# Altium schematic sheet 60_RESISTANCE_FRONTEND.SchDoc
size A; SheetNumber: 7; SheetTotal: 8
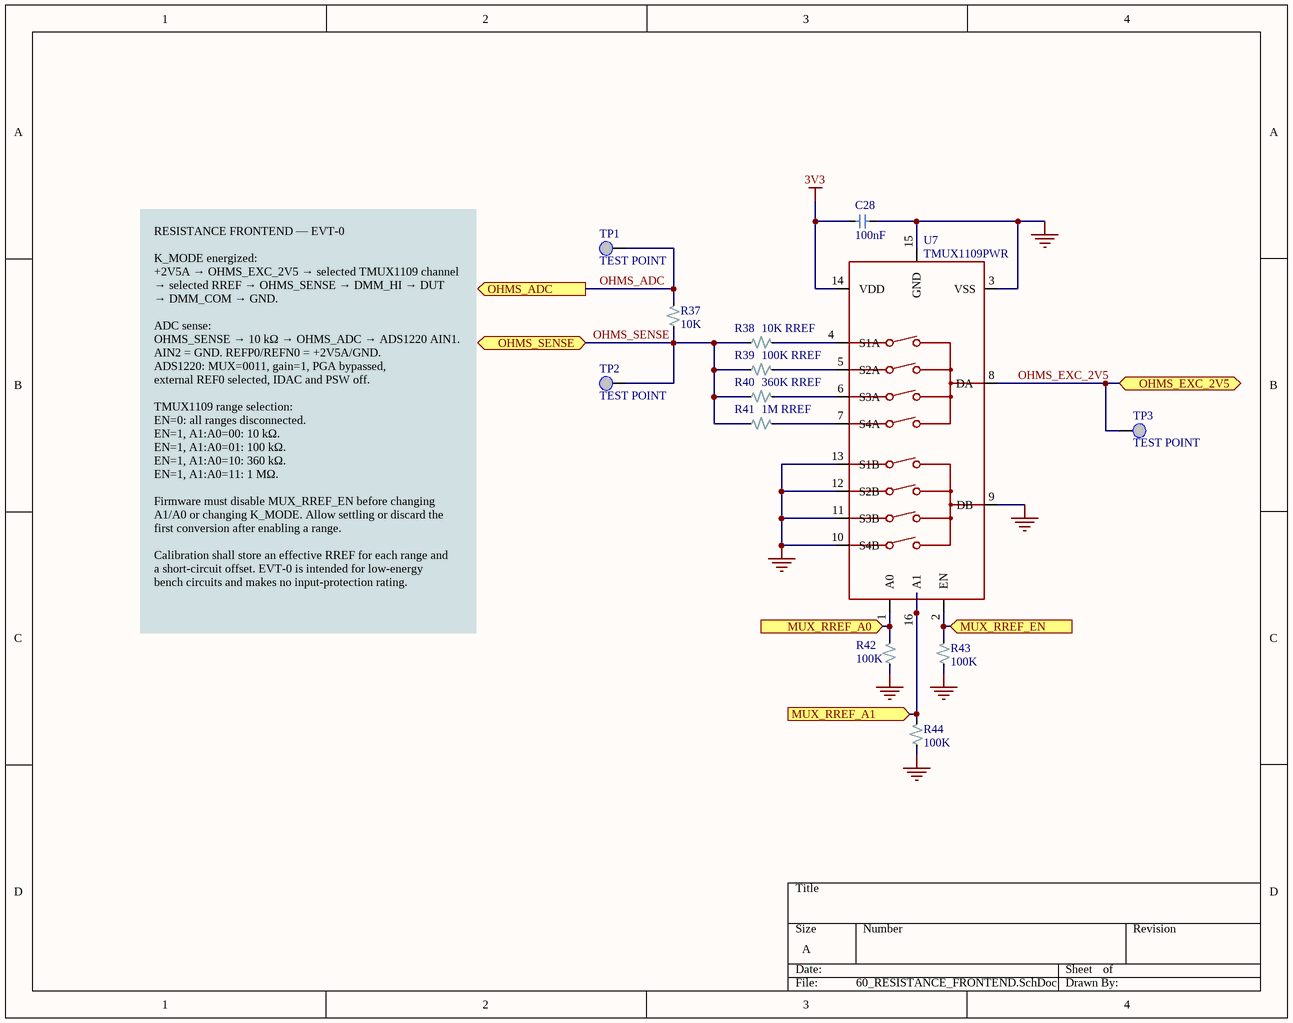
[diagram p0: 60_RESISTANCE_FRONTEND.SchDoc]

## Parts
C28  100nF  [C0805]
R37  10K  [R0805]
R38  10K RREF  [R0805]
R39  100K RREF  [R0805]
R40  360K RREF  [R0805]
R41  1M RREF  [R0805]
R42  100K  [R0805]
R43  100K  [R0805]
R44  100K  [R0805]
TP1  TEST POINT  [TP_SMD_1P5MM]
TP2  TEST POINT  [TP_SMD_1P5MM]
TP3  TEST POINT  [TP_SMD_1P5MM]
U7  TMUX1109PWR  [TMUX1109PWR]

## Ports
MUX_RREF_A0 (in, see 00_SYSTEM_TOP[3B], 20_MCU_BLE[1C]), MUX_RREF_A1 (in, see 00_SYSTEM_TOP[3B], 20_MCU_BLE[1C]), MUX_RREF_EN (in, see 00_SYSTEM_TOP[3B], 20_MCU_BLE[1C]), OHMS_ADC (out, see 00_SYSTEM_TOP[3B], 30_ADC[2C]), OHMS_EXC_2V5 (bidir, see 00_SYSTEM_TOP[4B], 40_INPUT_ROUTING[1C]), OHMS_SENSE (bidir, see 00_SYSTEM_TOP[3B], 40_INPUT_ROUTING[2B])

## Nets
3V3: C28.2 U7.14(VDD)
GND: C28.1 R42.1 R43.1 R44.1 U7.3(VSS) U7.9(DB) U7.10(S4B) U7.11(S3B) U7.12(S2B) U7.13(S1B) U7.15(GND)
MUX_RREF_A0: R42.2 U7.1(A0) ; port MUX_RREF_A0
MUX_RREF_A1: R44.2 U7.16(A1) ; port MUX_RREF_A1
MUX_RREF_EN: R43.2 U7.2(EN) ; port MUX_RREF_EN
OHMS_ADC: R37.2 TP1.1 ; port OHMS_ADC
OHMS_EXC_2V5: TP3.1 U7.8(DA) ; port OHMS_EXC_2V5
OHMS_SENSE: R37.1 R38.1 R39.1 R40.1 R41.1 TP2.1 ; port OHMS_SENSE
NetR38_2: R38.2 U7.4(S1A)
NetR39_2: R39.2 U7.5(S2A)
NetR40_2: R40.2 U7.6(S3A)
NetR41_2: R41.2 U7.7(S4A)

## Notes on the sheet
- RESISTANCE FRONTEND — EVT-0
  K_MODE energized:
  +2V5A → OHMS_EXC_2V5 → selected TMUX1109 channel
  → selected RREF → OHMS_SENSE → DMM_HI → DUT
  → DMM_COM → GND.
  ADC sense:
  OHMS_SENSE → 10 kΩ → OHMS_ADC → ADS1220 AIN1.
  AIN2 = GND. REFP0/REFN0 = +2V5A/GND.
  ADS1220: MUX=0011, gain=1, PGA bypassed,
  external REF0 selected, IDAC and PSW off.
  TMUX1109 range selection:
  EN=0: all ranges disconnected.
  EN=1, A1:A0=00: 10 kΩ.
  EN=1, A1:A0=01: 100 kΩ.
  EN=1, A1:A0=10: 360 kΩ.
  EN=1, A1:A0=11: 1 MΩ.
  Firmware must disable MUX_RREF_EN before changing A1/A0 or changing K_MODE. Allow settling or discard the first conversion after enabling a range.
  Calibration shall store an effective RREF for each range and
  a short-circuit offset. EVT-0 is intended for low-energy
  bench circuits and makes no input-protection rating.

## Library data of the parts
C28 = C_0805
R37-R44 = R_0805: RES 1/8W 0805; Manufacturer: Stackpole Electronics; Manufacturer Part Number: RNCF0805TKY10K0; Manufacturer Package Identifier: 0805 (2012 metric); Max Power Dissipation: 125mW; Value: 10kΩ; Temperature Coefficient: 5ppm/°C; Tolerance: 0.01%; Working Voltage: 150V; Supplier: DigiKey; Supplier Part Number: RNCF0805TKY10K0CT-ND; RoHS: Compliant; Category: Chip SMD Resistors; Stock: 4649; Pricing: 1=1.61, 10=1.334, 50=1.1716, 100=1.1105, 500=0.99044, 1000=0.94751, 2000=0.90945, 3000=0.8893, 5000=0.86599, 7000=0.85183, 10000=0.8378 (USD); Case/Package: 0805; Case Code (Imperial): 0805; Case Code (Metric): 2012; Composition: Thin Film; Country of Origin: Taiwan; Export Control Classification Number (ECCN) Code: EAR99; Features: Moisture Resistant; Height: 550µm; Harmonized Tariff Schedule (HTS) Code: 8533.21.00.30; Introduction Date: 2011-06-03; Lead Free: Lead Free; Length: 2mm; Lifecycle Status: Production; Max Operating Temperature: 155°C; Min Operating Temperature: -55°C; Mounting Technology: Surface Mount; Number of Terminals: 2; Number of Terminations: 2; Packaging: Tape & Reel (TR); Power Rating: 125mW; Ratings: AEC-Q200; REACH SVHC: Yes; Schedule B: 8533210045, 8533210045|8533210045|8533210045|8533210045|8533210045; Width: 1.25mm; ComponentLink1URL: https://datasheet.octopart.com:443/RNCF0805TKY10K0-Stackpole-Electronics-datasheet-182148124.pdf?src-supplier=IHS; ComponentLink1Description: https://datasheet.octopart.com:443/RNCF0805TKY10K0-Stackpole-Electronics-datasheet-182148124.pdf?src-supplier=IHS; ComponentLink2URL: https://datasheet.octopart.com:443/RNCF0805TKY10K0-Stackpole-Electronics-datasheet-12511394.pdf?src-supplier=Factory+Futures; ComponentLink2Description: https://datasheet.octopart.com:443/RNCF0805TKY10K0-Stackpole-Electronics-datasheet-12511394.pdf?src-supplier=Factory+Futures; ComponentLink3URL: https://datasheet.octopart.com:443/RNCF0805TKY10K0-Stackpole-Electronics-datasheet-141158876.pdf?src-supplier=Stackpole+Electronics; ComponentLink3Description: https://datasheet.octopart.com:443/RNCF0805TKY10K0-Stackpole-Electronics-datasheet-141158876.pdf?src-supplier=Stackpole+Electronics; ComponentLink4URL: https://datasheet.octopart.com:443/RNCF0805TKY10K0-Stackpole-Electronics-datasheet-28504821.pdf?src-supplier=Master+Electronics; ComponentLink4Description: https://datasheet.octopart.com:443/RNCF0805TKY10K0-Stackpole-Electronics-datasheet-28504821.pdf?src-supplier=Master+Electronics; ComponentLink5URL: https://datasheet.octopart.com/RNCF0805TKY10K0-Stackpole-Electronics-datasheet-11755897.pdf; ComponentLink5Description: https://datasheet.octopart.com/RNCF0805TKY10K0-Stackpole-Electronics-datasheet-11755897.pdf; ComponentLink6URL: http://sigma.octopart.com:80/15941409/materials_sheet/Stackpole-Electronics-RNCF0805TKY10K0.pdf?src-supplier=Compliance+Statements; ComponentLink6Description: http://sigma.octopart.com:80/15941409/materials_sheet/Stackpole-Electronics-RNCF0805TKY10K0.pdf?src-supplier=Compliance+Statements; ComponentLink7URL: http://sigma.octopart.com:80/141158212/rohs_statement/Stackpole-Electronics-RNCF0805TKY10K0.pdf?src-supplier=Compliance+Statements; ComponentLink7Description: http://sigma.octopart.com:80/141158212/rohs_statement/Stackpole-Electronics-RNCF0805TKY10K0.pdf?src-supplier=Compliance+Statements; ComponentLink8URL: http://sigma.octopart.com:80/141158211/reach_statement/Stackpole-Electronics-RNCF0805TKY10K0.pdf?src-supplier=Compliance+Statements; ComponentLink8Description: http://sigma.octopart.com:80/141158211/reach_statement/Stackpole-Electronics-RNCF0805TKY10K0.pdf?src-supplier=Compliance+Statements
TP1-TP3 = TP_1.0MM: SMD TEST POINT
U7 = TMUX1109PWR: 4 4.9Ω Double Pole Four Throw (DP4T) TSSOP-16-175mil Analog Switches, Multiplexers ROHS; Manufacturer: Texas Instruments; Manufacturer Lifecycle Status: ACTIVE; -3db Bandwidth: 135MHz; Max Junction Temperature (Tj): 150°C; Max Supply Voltage: 5.5V; Min Supply Voltage: 1.08V; Nominal Supply Current: 8nA; Number of Channels: 2; On-State Resistance: 1.8Ω; Value: 2.5Ω; Supplier: DigiKey; Supplier Part Number: 296-53438-1-ND; Manufacturer Part Number: TMUX1109PWR; RoHS: Compliant; Category: Analog Switches and Multiplexers; Stock: 4345; Pricing: 1=4.6, 10=3.492, 25=3.2144, 100=2.9097, 250=2.76432, 500=2.76318 (USD); Ambient Temperature Range High: 125°C; Case/Package: TSSOP; Height: 1.2mm; Length: 5mm; Lifecycle Status: Production; Max Operating Temperature: 125°C; Min Operating Temperature: -40°C; Number of Circuits: 2; Pins: 16; Schedule B: 8542390000, 8542390000|8542390000, 8542390000|8542390000|8542390000|8542390000|8542390000; Thickness: 1mm; Width: 4.4mm; ComponentLink1URL: https://sigma.octopart.com:443/189718192/technical_drawing/Texas-Instruments-TMUX1109PWR.pdf?src-supplier=Texas+Instruments; ComponentLink1Description: https://sigma.octopart.com:443/189718192/technical_drawing/Texas-Instruments-TMUX1109PWR.pdf?src-supplier=Texas+Instruments; ComponentLink2URL: https://octopart.com:443/opatz8j6/c1?t=lrqLgxqhOv5mRhW8sYJ4a35mRCMrE9WTtZWYXTuQwc5VAvwww8s9_bUQK_GQRUezFeOkf0xzYxG6KZlaBbzSWezLsR3Ws1FdDXdfW4axWjQfpVRIkxDZut9IKoVYaUCFWQ7mgDq3Uq0jZs542GlN5nOoAbYMoylPUhn7HG8S4oC_MsKR6_xb-xxtq9szC0WY0b2a732R0pvwpvNk8ULRxEmsgTiAI1WSnroIRWDIOCjtfrtMf_RErv3i4jOvYKsBRMPWwGfeEPsuFT0V9Dfo4Upi1cqJYXKTDqVzHb1Z1EghRgojnojRRDIQ4SqyN7fGhC2vBhmR1QUPkywNlMfenpxNL04oXP2EX7UUIAtjSyjFOVV8L-MsmAtzvJRRZT-j-bFIxkN0&src-supplier=Texas+Instruments; ComponentLink2Description: https://octopart.com:443/opatz8j6/c1?t=lrqLgxqhOv5mRhW8sYJ4a35mRCMrE9WTtZWYXTuQwc5VAvwww8s9_bUQK_GQRUezFeOkf0xzYxG6KZlaBbzSWezLsR3Ws1FdDXdfW4axWjQfpVRIkxDZut9IKoVYaUCFWQ7mgDq3Uq0jZs542GlN5nOoAbYMoylPUhn7HG8S4oC_MsKR6_xb-xxtq9szC0WY0b2a732R0pvwpvNk8ULRxEmsgTiAI1WSnroIRWDIOCjtfrtMf_RErv3i4jOvYKsBRMPWwGfeEPsuFT0V9Dfo4Upi1cqJYXKTDqVzHb1Z1EghRgojnojRRDIQ4SqyN7fGhC2vBhmR1QUPkywNlMfenpxNL04oXP2EX7UUIAtjSyjFOVV8L-MsmAtzvJRRZT-j-bFIxkN0&src-supplier=Texas+Instruments; ComponentLink3URL: https://sigma.octopart.com:443/116621398/technical_drawing/Texas-Instruments-TMUX1109PWR.pdf?src-supplier=Texas+Instruments; ComponentLink3Description: https://sigma.octopart.com:443/116621398/technical_drawing/Texas-Instruments-TMUX1109PWR.pdf?src-supplier=Texas+Instruments; ComponentLink4URL: https://datasheet.octopart.com:443/TMUX1109PWR-Texas-Instruments-datasheet-150595089.pdf?src-supplier=SHENGYU+ELECTRONICS; ComponentLink4Description: https://datasheet.octopart.com:443/TMUX1109PWR-Texas-Instruments-datasheet-150595089.pdf?src-supplier=SHENGYU+ELECTRONICS; ComponentLink5URL: http://sigma.octopart.com:80/reach_statement/Texas-Instruments-company-64.pdf?src-supplier=Compliance+Statements; ComponentLink5Description: http://sigma.octopart.com:80/reach_statement/Texas-Instruments-company-64.pdf?src-supplier=Compliance+Statements; ComponentLink6URL: http://sigma.octopart.com:80/conflict_mineral_statement/Texas-Instruments-company-63.pdf?src-supplier=Compliance+Statements; ComponentLink6Description: http://sigma.octopart.com:80/conflict_mineral_statement/Texas-Instruments-company-63.pdf?src-supplier=Compliance+Statements